# Altium schematic sheet Main.SchDoc
size A4; Organization: Altium Limited; Address1: L3, 12a Rodborough Rd; Address2: Frenchs Forest; Address3: NSW; Address4: Australia 2086; SheetNumber: 1; SheetTotal: 7
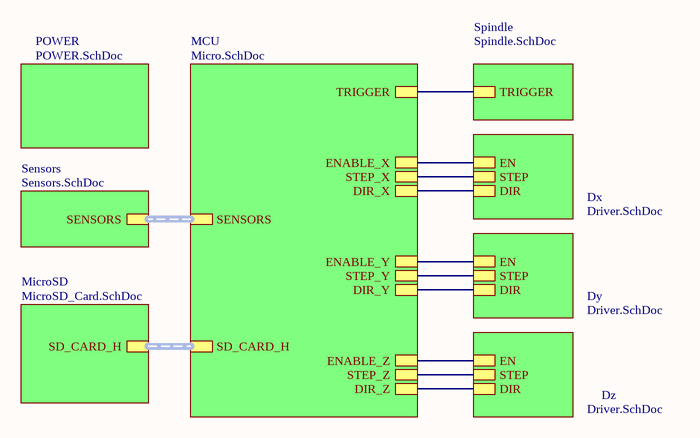
[diagram p0: Main.SchDoc]

## Sub-sheets
Dx = Driver.SchDoc: EN, STEP, DIR
Dy = Driver.SchDoc: EN, STEP, DIR
Dz = Driver.SchDoc: EN, STEP, DIR
MCU = Micro.SchDoc: SD_CARD_H (harness SD_CARD_T), SENSORS (harness SENSOR), TRIGGER, ENABLE_X, STEP_X, DIR_X, ENABLE_Y, STEP_Y, DIR_Y, ENABLE_Z, STEP_Z, DIR_Z
MicroSD = MicroSD_Card.SchDoc: SD_CARD_H (harness SD_CARD_T)
POWER = POWER.SchDoc: no entries
Sensors = Sensors.SchDoc: SENSORS (harness SENSOR)
Spindle = Spindle.SchDoc: TRIGGER

## Nets
(unnamed): sheet Spindle/TRIGGER, sheet MCU/TRIGGER
(unnamed): sheet Dx/EN, sheet MCU/ENABLE_X
(unnamed): sheet Dx/STEP, sheet MCU/STEP_X
(unnamed): sheet Dx/DIR, sheet MCU/DIR_X
(unnamed): sheet Dy/EN, sheet MCU/ENABLE_Y
(unnamed): sheet Dy/STEP, sheet MCU/STEP_Y
(unnamed): sheet Dy/DIR, sheet MCU/DIR_Y
(unnamed): sheet Dz/EN, sheet MCU/ENABLE_Z
(unnamed): sheet Dz/STEP, sheet MCU/STEP_Z
(unnamed): sheet Dz/DIR, sheet MCU/DIR_Z

## Buses and harness runs
harness sheet MCU/SD_CARD_H = sheet MicroSD/SD_CARD_H
harness sheet MCU/SENSORS = sheet Sensors/SENSORS

## Notes on the sheet
- Title
- Size:
- Date:
- A4
- Number:
- Time:
- Revision:
- Sheet
- of
- File: